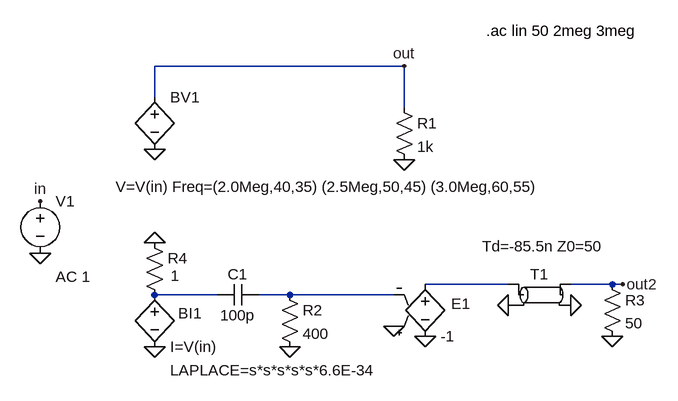
[diagram p0: schematic Lap1.asc]
Lap1.asc, the LTspice schematic file:
Version 4
SHEET 1 1076 680
WIRE 288 48 288 0
WIRE 288 0 672 0
WIRE 672 0 672 64
WIRE 656 352 496 352
WIRE 496 352 448 352
WIRE 928 336 992 336
WIRE 992 336 1008 336
WIRE 832 336 704 336
WIRE 384 352 288 352
FLAG 288 128 0
FLAG 672 144 0
FLAG 112 288 0
FLAG 112 208 in
FLAG 672 0 out
FLAG 288 432 0
FLAG 496 432 0
FLAG 704 416 0
FLAG 832 368 0
FLAG 1008 336 out2
FLAG 992 416 0
FLAG 928 368 0
FLAG 656 400 0
FLAG 288 272 0
SYMBOL bv 288 32 R0
WINDOW 3 -60 154 Left 0
SYMATTR Value V=V(in) Freq=(2.0Meg,40,35) (2.5Meg,50,45) (3.0Meg,60,55)
SYMATTR InstName BV1
SYMBOL res 656 48 R0
SYMATTR InstName R1
SYMATTR Value 1k
SYMBOL voltage 112 192 R0
WINDOW 123 24 132 Left 0
WINDOW 39 0 0 Left 0
SYMATTR Value2 AC 1
SYMATTR InstName V1
SYMATTR Value ""
SYMBOL bv 288 336 R0
WINDOW 123 24 132 Left 0
WINDOW 0 36 44 Left 0
SYMATTR Value2 LAPLACE=s*s*s*s*s*6.6E-34
SYMATTR InstName BI1
SYMATTR Value I=V(in)
SYMBOL cap 384 368 R270
WINDOW 0 32 32 VTop 0
WINDOW 3 0 32 VBottom 0
SYMATTR InstName C1
SYMATTR Value 100p
SYMBOL res 480 336 R0
SYMATTR InstName R2
SYMATTR Value 400
SYMBOL tline 880 352 R0
WINDOW 3 -88 -75 Left 0
SYMATTR Value Td=-85.5n Z0=50
SYMATTR InstName T1
SYMBOL res 976 320 R0
SYMATTR InstName R3
SYMATTR Value 50
SYMBOL e2 704 320 R0
WINDOW 0 40 46 Left 0
SYMATTR InstName E1
SYMATTR Value -1
SYMBOL res 272 256 R0
WINDOW 3 41 67 Left 0
SYMATTR InstName R4
SYMATTR Value 1
TEXT 798 -54 Left 0 !.ac lin 50 2meg 3meg

The netlist it stands for:
* Lap1.asc
BV1 out 0 V=V(in) Freq=(2.0Meg,40,35) (2.5Meg,50,45) (3.0Meg,60,55)
R1 out 0 1k
V1 in 0 AC 1
BI1 N003 0 I=V(in) LAPLACE=s*s*s*s*s*6.6E-34
C1 N003 N001 100p
R2 N001 0 400
T1 N002 0 out2 0 Td=-85.5n Z0=50
R3 out2 0 50
E1 N002 0 0 N001 -1
R4 0 N003 1
.ac lin 50 2meg 3meg
.backanno
.end